# EAGLE design CH6 IMU and GPS (EAGLE 9.3.0)
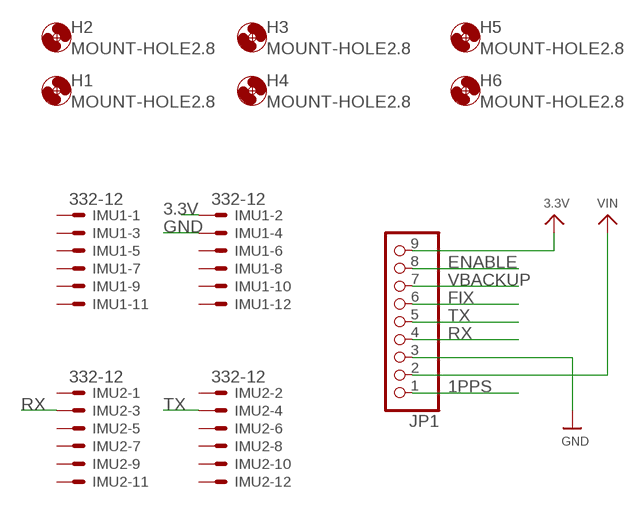
[diagram p0: schematic, sheet 1]

## Parts
H1  MOUNT-HOLE2.8  [2,8]
H2  MOUNT-HOLE2.8  [2,8]
H3  MOUNT-HOLE2.8  [2,8]
H4  MOUNT-HOLE2.8  [2,8]
H5  MOUNT-HOLE2.8  [2,8]
H6  MOUNT-HOLE2.8  [2,8]
IMU1  332-12  [332-12]
IMU2  332-12  [332-12]
JP1  HEADER-1X970MIL  [1X09_ROUND_70]

## Nets
1PPS: JP1.1
3.3V: IMU1.2 JP1.9
ENABLE: JP1.8
FIX: JP1.6
GND: IMU1.4 JP1.3
RX: IMU2.3 JP1.4
TX: IMU2.4 JP1.5
VBACKUP: JP1.7
VIN: JP1.2
Unconnected: IMU1.1 IMU1.3 IMU1.5 IMU1.6 IMU1.7 IMU1.8 IMU1.9 IMU1.10 IMU1.11 IMU1.12 IMU2.1 IMU2.2 IMU2.5 IMU2.6 IMU2.7 IMU2.8 IMU2.9 IMU2.10 IMU2.11 IMU2.12

## Library data of the parts
H1-H6 = holes:MOUNT-HOLE: MOUNTING HOLE with drill center marker
IMU1 IMU2 = con-garry:332-12: 12 Pin - 2mm Dual Row Source: www.mpe-connector.de / garry_shortform_2012.pdf
JP1 = microbuilder:HEADER-1X9: PIN HEADER

## Board
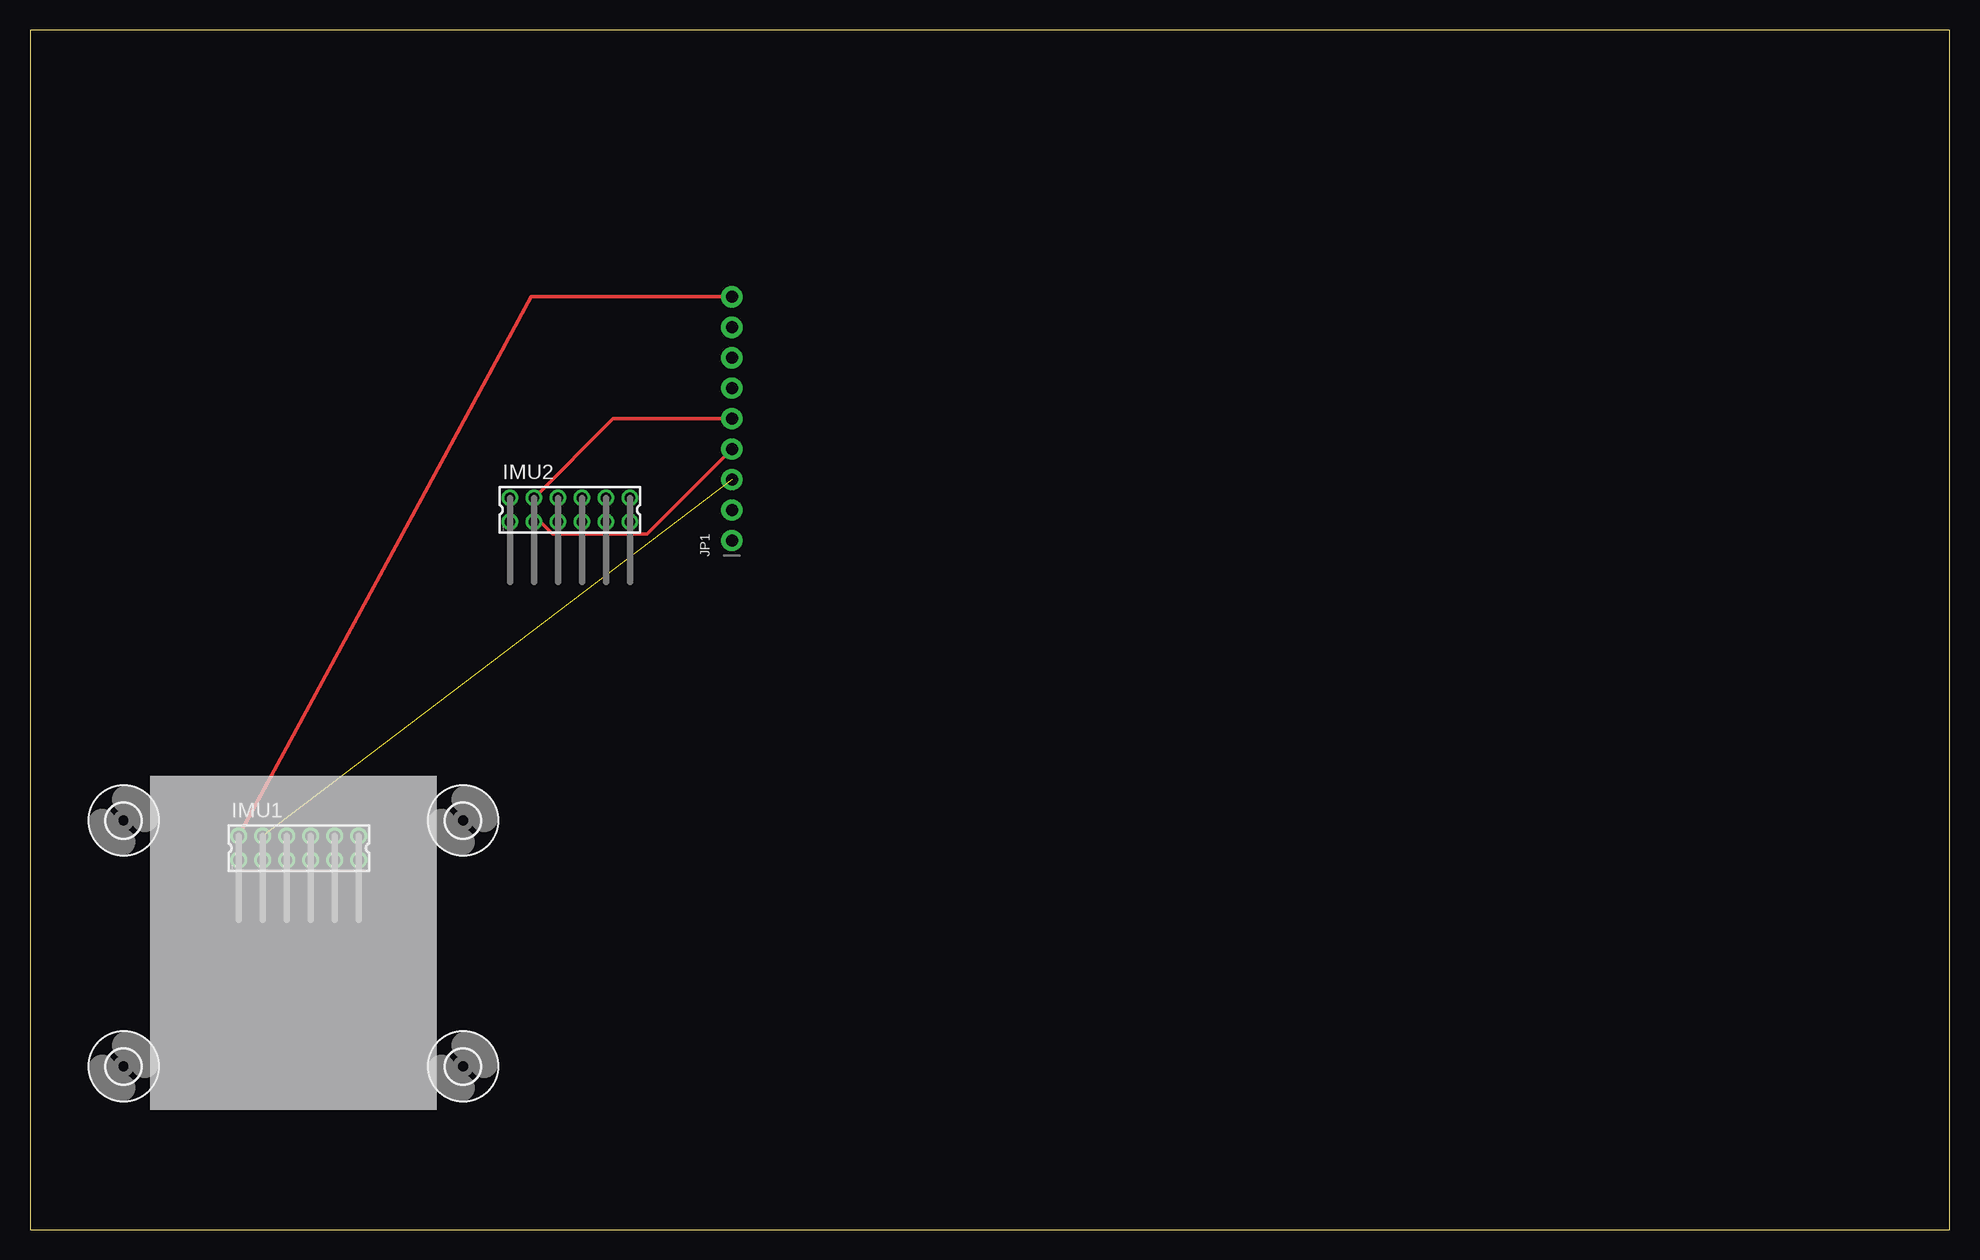
[diagram p1: board, top side]

Size 160 x 100 mm. Coordinates in mm from the lower left corner, seen from the top.
Outline: 0,0 160,0 160,100 0,100 0,0
Copper layers (1*16): Top 0.035mm / dielectric 1.5mm / Bottom 0.035mm
Design rules "default": minimum track width 6mil, minimum drill 0.35mm, track to track 6mil, track to pad 6mil, pad to pad 6mil, via to via 6mil, smd to smd 6mil, copper to edge 40mil, drill to drill 6mil, minimum pad ring 10mil, minimum via ring 8mil, stop-mask expansion 4mil, vias tented up to drill 0mil, thermal gap 10mil

### Footprints (pad centres in the part's own frame; a part is rotated, then mirrored left to right if it is on the bottom)
2,8 = hole 2.8: 0,0
332-12 = drill 0.9 pad 1.27: 1 -5,-1; 2 -5,1; 3 -3,-1; 4 -3,1; 5 -1,-1; 6 -1,1; 7 1,-1; 8 1,1; 9 3,-1; 10 3,1; 11 5,-1; 12 5,1
1X09_ROUND_70 = drill 1 pad 1.778: 1 -10.16,0; 2 -7.62,0; 3 -5.08,0; 4 -2.54,0; 5 0,0; 6 2.54,0; 7 5.08,0; 8 7.62,0; 9 10.16,0

### Placement (x,y rotation side)
H1  7.8,34.1 0 top
H2  36.1,34.1 0 top
H3  7.8,13.6 0 top
H4  36.1,13.6 0 top
H5  4,-36 0 top  (outside the outline)
H6  4,-44 0 top  (outside the outline)
IMU1  22.4,31.8 0 top
IMU2  45,60 0 top
JP1  58.5,67.6 90 top

### Tracks (layer width: path | path; a pad name or v marks a point on that pad's centre or on a via)
3.3V
  Top 0.305: IMU1.2 41.76,77.76 JP1.9
GND  (1 unrouted)
RX
  Top 0.305: IMU2.3 42.57,59 43.58,57.99 51.43,57.99 JP1.4
TX
  Top 0.305: IMU2.4 48.6,67.6 JP1.5